# Altium schematic sheet jtag.SchDoc
size A
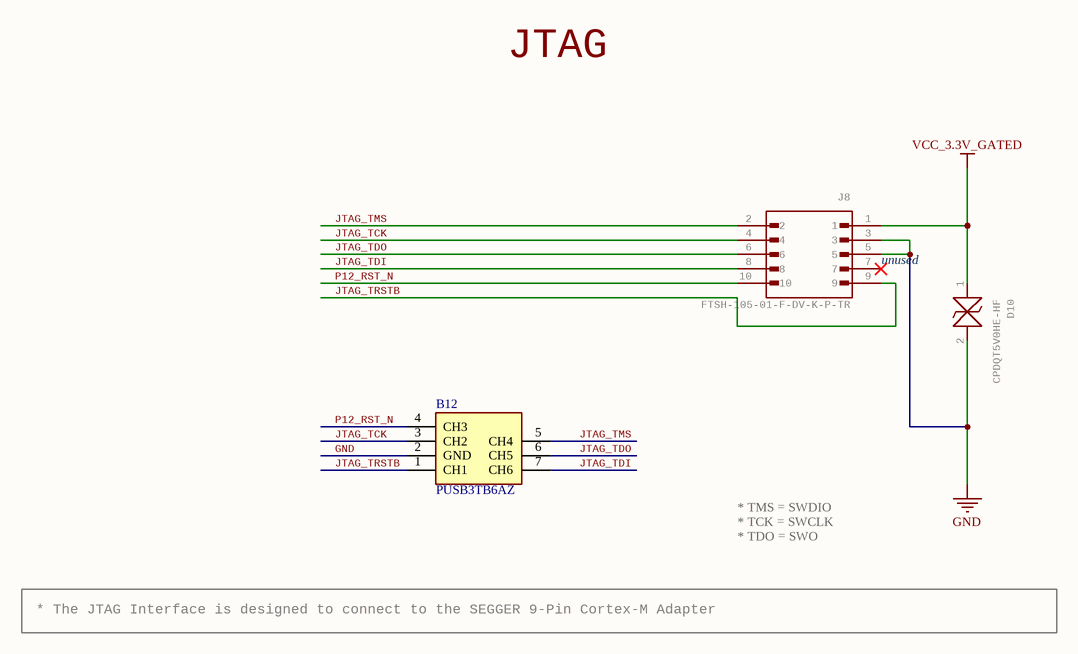
[diagram p0: jtag.SchDoc]

## Parts
B12  PUSB3TB6AZ  [PUSB3TB6AZ]
D10  CPDQT5V0HE-HF  [CPDQT5V0HEHF]
J8  FTSH-105-01-F-DV-K-P-TR  [CNC_3221-10-0300-00]

## Nets
GND: B12.2(GND) D10.2 J8.3 J8.5
VCC_3.3V_GATED: D10.1 J8.1
JTAG_TCK: B12.3(CH2) J8.4
JTAG_TDI: B12.7(CH6) J8.8
JTAG_TDO: B12.6(CH5) J8.6
JTAG_TMS: B12.5(CH4) J8.2
JTAG_TRSTB: B12.1(CH1) J8.9
P12_RST_N: B12.4(CH3) J8.10

Not connected (* = marked no-connect by the designer): J8 7*

## Notes on the sheet
- JTAG
- (near J8) unused
- * The JTAG Interface is designed to connect to the SEGGER 9-Pin Cortex-M Adapter
- * TMS = SWDIO
  * TCK = SWCLK
  * TDO = SWO

## Library data of the parts
B12 = PUSB3TB6AZ: NEXPERIA - PUSB3TB6AZ - DIODE, ESD PROTECTION, 5.5V, 0.27PF; Geometry.Height: 0.5mm; Mouser Part Number: 771-PUSB3TB6AZ; Mouser Price/Stock: https://www.mouser.co.uk/ProductDetail/Nexperia/PUSB3TB6AZ?qs=K2OaAKmNuLgsAI4MRas6Xw%3D%3D; Manufacturer_Name: Nexperia; Manufacturer_Part_Number: PUSB3TB6AZ; Datasheet Link: https://assets.nexperia.com/documents/data-sheet/PUSB3TB6.pdf; Part Number: PUSB3TB6AZ; MPN: PUSB3TB6AZ
D10 = CPDQT5V0HE-HF: ESD Suppressors / TVS Diodes DIODE ESD 5VWM 65W 0402/SOD-923F   Source:  Datasheet; MANUFACTURER_NAME: Comchip Technology; GateName_1: G$1; SymbolName_1: CPDQT5V0HE-HF; LibraryName: CPDQT5V0HE-HF; DeviceSetName: CPDQT5V0HE-HF; HEIGHT: 0.42mm; MANUFACTURER_PART_NUMBER: CPDQT5V0HE-HF; MOUSER_PART_NUMBER: MOUSER_PART_NUMBER; MOUSER_PRICE-STOCK: MOUSER_PRICE-STOCK; MPN: CPDQT5V0HE-HF; Part Number: CPDQT5V0HE-HF
J8 = 3221-10-0300-00: Check availability; GateName_1: G$1; MF: CNC Tech; SymbolName_1: 3221-10-0300-00; LibraryName: 3221-10-0300-00; DeviceSetName: 3221-10-0300-00; AVAILABILITY: In Stock; MP: FTSH-105-01-F-DV-K-P-TR; MPN: FTSH-105-01-F-DV-K-P-TR; PACKAGE: None; PRICE: None; PURCHASE-URL: https://pricing.snapeda.com/search/part/3221-10-0300-00/?ref=eda; Part Number: FTSH-105-01-F-DV-K-P-TR